# EAGLE schematic dac_for_pi (EAGLE 6.5.0)
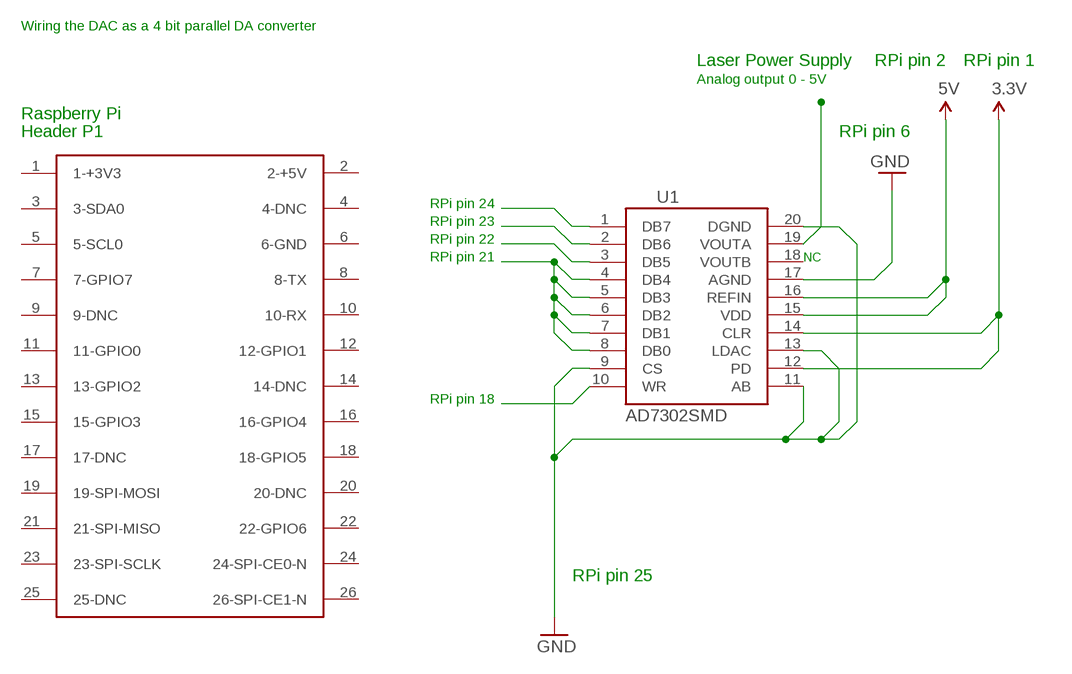
[diagram p0: schematic, sheet 1]

## Parts
U1  AD7302SMD  [TSSOP20]
U$1  RASPBERRY-PI  [RASPBERRY-PI]

## Nets
3.3V: U1.12(PD) U1.14(CLR)
5V: U1.15(VDD) U1.16(REFIN)
GND: U1.9(CS) U1.11(AB) U1.13(LDAC) U1.17(AGND) U1.20(DGND)
N$1: U1.4(DB4) U1.5(DB3) U1.6(DB2) U1.7(DB1) U1.8(DB0)
N$4: U1.19(VOUTA)
N$6: U1.3(DB5)
N$7: U1.2(DB6)
N$8: U1.1(DB7)
N$9: U1.10(WR)
Unconnected: U1.18(VOUTB) U$1.1(1-+3V3) U$1.2(2-+5V) U$1.3(3-SDA0) U$1.4(4-DNC) U$1.5(5-SCL0) U$1.6(6-GND) U$1.7(7-GPIO7) U$1.8(8-TX) U$1.9(9-DNC) U$1.10(10-RX) U$1.11(11-GPIO0) U$1.12(12-GPIO1) U$1.13(13-GPIO2) U$1.14(14-DNC) U$1.15(15-GPIO3) U$1.16(16-GPIO4) U$1.17(17-DNC) U$1.18(18-GPIO5) U$1.19(19-SPI-MOSI) U$1.20(20-DNC) U$1.21(21-SPI-MISO) U$1.22(22-GPIO6) U$1.23(23-SPI-SCLK) U$1.24(24-SPI-CE0-N) U$1.25(25-DNC) U$1.26(26-SPI-CE1-N)

## Notes on the sheet
- Wiring the DAC as a 4 bit parallel DA converter
- Laser Power Supply | RPi pin 2 | RPi pin 1
- Analog output 0 - 5V
- Raspberry Pi
- Header P1 | RPi pin 6
- RPi pin 24
- RPi pin 23
- RPi pin 22
- RPi pin 21 | NC
- RPi pin 18
- RPi pin 25

## Library data of the parts
U1 = SparkFun:AD7302: AD7302
U$1 = RaspberryPi:RASPBERRY-PI: Raspberry Pi Board <http://www.raspberrypi.org/> Jacques Lagnel V1.0 (beta) 2012 Board dimension: Forum 3D model <http://www.raspberrypi.org/forum/general-discussion/mechanical-profile-3d-models?value=3d%20model&type=1&include=1&search=1&ret=all> The GPIO Connector (P1): http://elinux.org/RPi_Low-level_peripherals